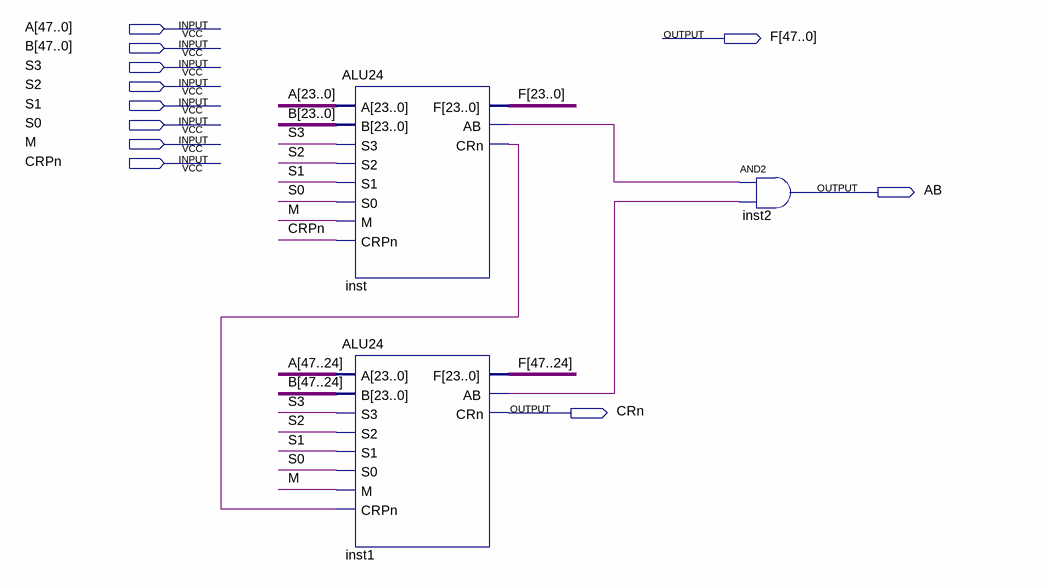
[diagram p0: schematic sheet]
// Quartus schematic ALU48.bdf as structural Verilog: 3 symbols, 11 pins
module ALU48 (
  input  [47:0] A,
  input  [47:0] B,
  input  S3,
  input  S2,
  input  S1,
  input  S0,
  input  M,
  input  CRPn,
  output [47:0] F,
  output AB,
  output CRn
);

  wire inst1_ab, inst_ab, inst_crn;

  ALU24 inst (
    .A(A[23:0]), .B(B[23:0]), .S3(S3), .S2(S2), .S1(S1), .S0(S0), .M(M), .CRPn(CRPn), .F(F[23:0]),
    .AB(inst_ab), .CRn(inst_crn));
  ALU24 inst1 (
    .A(A[47:24]), .B(B[47:24]), .S3(S3), .S2(S2), .S1(S1), .S0(S0), .M(M), .CRPn(inst_crn), .F(F[47:24]),
    .AB(inst1_ab), .CRn(CRn));
  and inst2 (AB, inst_ab, inst1_ab);
endmodule
